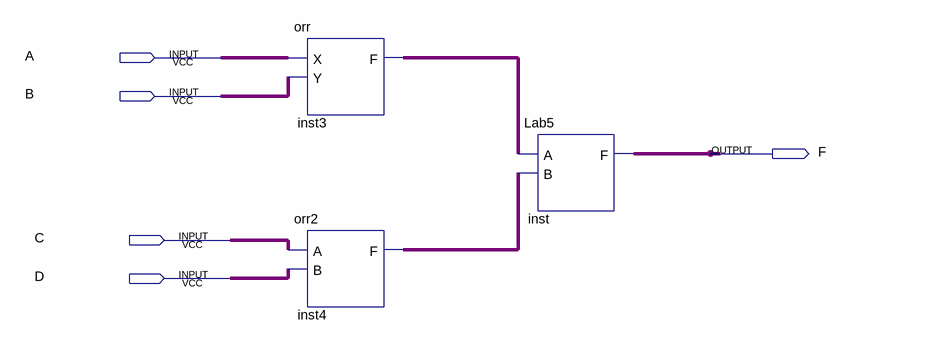
[diagram p0: schematic sheet]
// Quartus schematic Lab5_2.bdf as structural Verilog: 3 symbols, 5 pins
module Lab5_2 (
  input  A,
  input  B,
  input  C,
  input  D,
  output F
);

  wire inst3_f, inst4_f;

  orr inst3 (.X(A), .Y(B), .F(inst3_f));
  orr2 inst4 (.A(C), .B(D), .F(inst4_f));
  Lab5 inst (.A(inst3_f), .B(inst4_f), .F(F));
endmodule
